# EAGLE design Irdroid_USB (EAGLE 6.5.0)
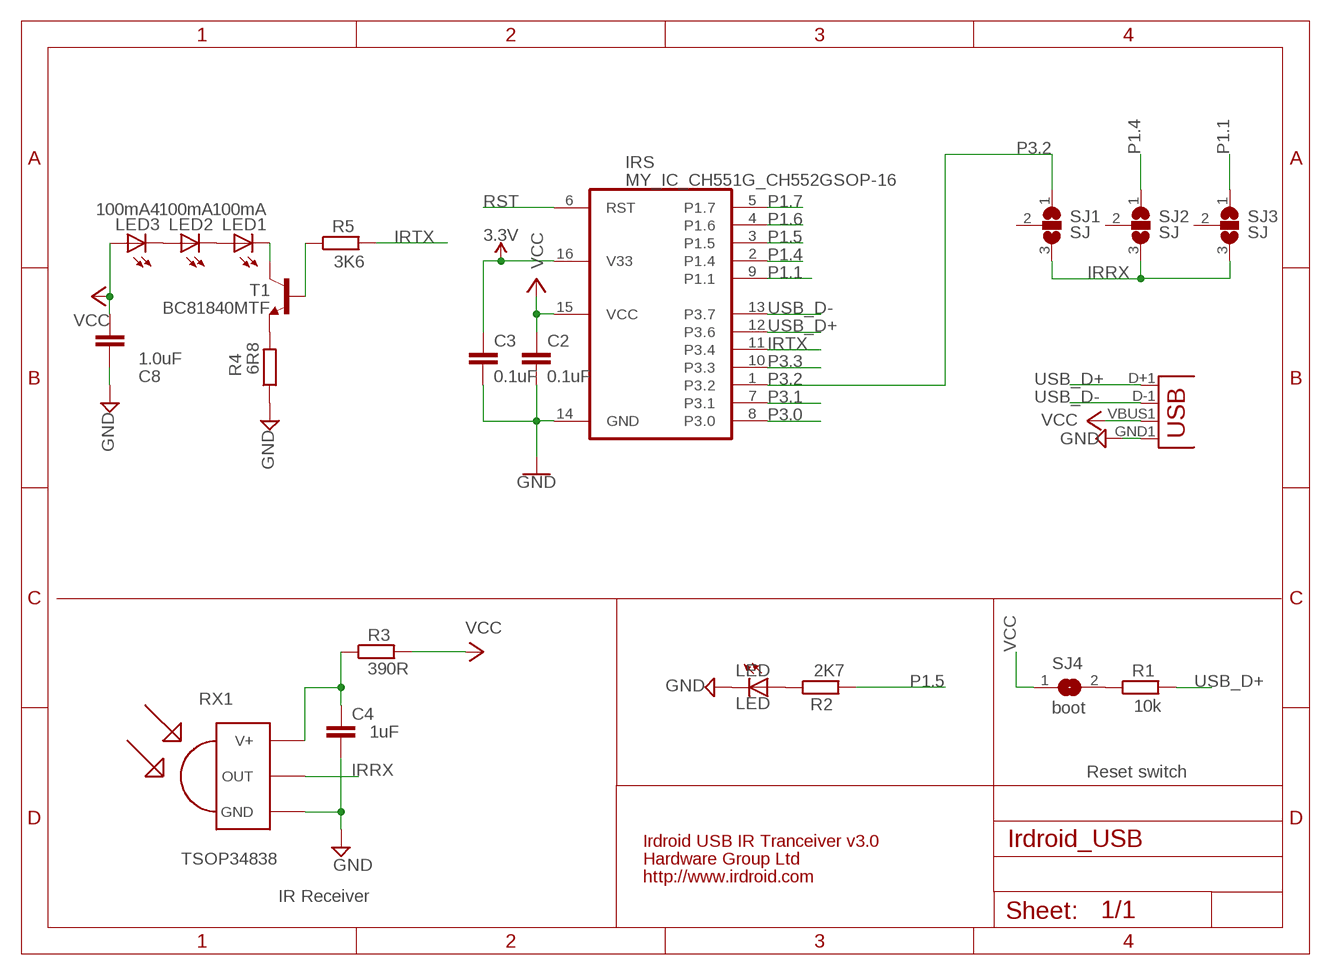
[diagram p0: schematic, sheet 1]

## Parts
C2  0.1uF  C-EUC0805K  [C0805K]
C3  0.1uF  C-EUC0805K  [C0805K]
C4  1uF  CAPC603  [C603]
C8  1.0uF  CAPC603  [C603]
IRS  MY_IC_CH551G_CH552GSOP-16  [MY_IC_SO16]
JP2  USBA-SMD-MALE  [USB-A-SMT-MALE]
LED  LED  LEDCHIP-LED0805  [CHIP-LED0805]
LED1  100mA  LED3MM  [LED3MM]
LED2  100mA  LED3MM  [LED3MM]
LED3  100mA4  LED3MM  [LED3MM]
R1  10k  RESISTORR603  [R603]
R2  2K7  RESISTORR603  [R603]
R3  390R  RESISTORR603  [R603]
R4  6R8  R-EU_M1206  [M1206]
R5  3K6  RESISTORR603  [R603]
RX  TSOP34838  TSOP4838  [TSOP18XX]
SJ1  SJ  SJ2W  [SJ_2]
SJ2  SJ  SJ2W  [SJ_2]
SJ3  SJ  SJ2W  [SJ_2]
SJ4  boot  SJ  [SJ]
T1  BC81840MTF  NPNSOT23BEC  [SOT23-BEC]

## Nets
3.3V: C3.1 IRS.16(V33)
GND: C2.2 C3.2 C4.2 C8.2 IRS.14(GND) JP2.GND1(GND) LED.C R4.1 RX.GND
IRRX: RX.OUT SJ1.3 SJ2.3 SJ3.3
IRTX: IRS.11(P3.4) R5.2
N$1: R1.1 SJ4.2
N$4: LED1.A LED2.K(C)
N$5: LED2.A LED3.K(C)
N$6: R4.2 T1.E
N$7: LED.A R2.1
N$8: C4.1 R3.1 RX.VCC(V+)
N$12: R5.1 T1.B
N$13: LED1.K(C) T1.C
P1.1: IRS.9(P1.1) SJ3.1
P1.4: IRS.2(P1.4) SJ2.1
P1.5: IRS.3(P1.5) R2.2
P1.6: IRS.4(P1.6)
P1.7: IRS.5(P1.7)
P3.0: IRS.8(P3.0)
P3.1: IRS.7(P3.1)
P3.2: IRS.1(P3.2) SJ1.1
P3.3: IRS.10(P3.3)
RST: IRS.6(RST)
USB_D+: IRS.12(P3.6) JP2.D+1(D+) R1.2
USB_D-: IRS.13(P3.7) JP2.D-1(D-)
VCC: C2.1 C8.1 IRS.15(VCC) JP2.VBUS1(VBUS) LED3.A R3.2 SJ4.1
Unconnected: SJ1.2 SJ2.2 SJ3.2

## Notes on the sheet
- RX1
- Reset switch
- Irdroid USB IR Tranceiver v3.0
- TSOP34838 | Hardware Group Ltd
- http://www.irdroid.com
- IR Receiver

## Library data of the parts
C2 C3 = rcl:C-EU: CAPACITOR, European symbol; LCSC: C16834; SPICEPREFIX: C
C4 C8 = dp_devices:CAP
IRS = myOwnLib:MY_IC_CH551G_CH552G; LCSC: C111292
JP2 = SparkFun-Connectors:USB: USB Connectors USB-B-PTH is fully proven SKU : PRT-00139/CONN-08278 USB-miniB is fully proven SKU : PRT-00587 USB-A-PCB is untested. USB-A-H is throughly reviewed, but untested. Spark Fun Electronics SKU : PRT-00437 USB-B-SMT is throughly reviewed, but untested. Needs silkscreen touching up. USB-A-S has not been used/tested USB-MB-H has not been used/tested USB-MICROB has been used. CONN-09505
LED LED1-LED3 = led:LED: LED OSRAM: - CHIPLED LG R971, LG N971, LY N971, LG Q971, LY Q971, LO R971, LY R971 LH N974, LH R974 LS Q976, LO Q976, LY Q976 LO Q996 - Hyper CHIPLED LW Q18S LB Q993, LB Q99A, LB R99A - SideLED LS A670, LO A670, LY A670, LG A670, LP A670 LB A673, LV A673, LT A673, LW A673 LH A674 LY A675 LS A676, LA A676, LO A676, LY A676, LW A676 LS A679, LY A679, LG A679 - Hyper Micro SIDELED® LS Y876, LA Y876, LO Y876, LY Y876 LT Y87S - SmartLED LW L88C, LW L88S LB L89C, LB L89S, LG L890 LS L89K, LO L89K, LY L89K LS L896, LA L896, LO L896, LY L896 - TOPLED LS T670, LO T670, LY T670, LG T670, LP T670 LSG T670, LSP T670, LSY T670, LOP T670, LYG T670 LG T671, LOG T671, LSG T671 LB T673, LV T673, LT T673, LW T673 LH T674 LS T676, LA T676, LO T676, LY T676, LB T676, LH T676, LSB T676, LW T676 LB T67C, LV T67C, LT T67C, LS T67K, LO T67K, LY T67K, LW E67C LS E67B, LA E67B, LO E67B, LY E67B, LB E67C, LV E67C, LT E67C LW T67C LS T679, LY T679, LG T679 LS T770, LO T770, LY T770, LG T770, LP T770 LB T773, LV T773, LT T773, LW T773 LH T774 LS E675, LA E675, LY E675, LS T675 LS T776, LA T776, LO T776, LY T776, LB T776 LHGB T686 LT T68C, LB T68C - Hyper Mini TOPLED® LB M676 - Mini TOPLED Santana® LG M470 LS M47K, LO M47K, LY M47K Source: http://www.osram.convergy.de LUXEON: - LUMILED® LXK2-PW12-R00, LXK2-PW12-S00, LXK2-PW14-U00, LXK2-PW14-V00 LXK2-PM12-R00, LXK2-PM12-S00, LXK2-PM14-U00 LXK2-PE12-Q00, LXK2-PE12-R00, LXK2-PE12-S00, LXK2-PE14-T00, LXK2-PE14-U00 LXK2-PB12-K00, LXK2-PB12-L00, LXK2-PB12-M00, LXK2-PB14-N00, LXK2-PB14-P00, LXK2-PB14-Q00 LXK2-PR12-L00, LXK2-PR12-M00, LXK2-PR14-Q00, LXK2-PR14-R00 LXK2-PD12-Q00, LXK2-PD12-R00, LXK2-PD12-S00 LXK2-PH12-R00, LXK2-PH12-S00 LXK2-PL12-P00, LXK2-PL12-Q00, LXK2-PL12-R00 Source: www.luxeon.com KINGBRIGHT: KA-3528ASYC Source: www.kingbright.com
R1-R3 R5 = dp_devices:RESISTOR
R4 = rcl:R-EU_: RESISTOR, European symbol
RX = tsop:TSOP4838: IR Receiver and Demodulator
SJ1-SJ3 = jumper:SJ2W: SMD solder JUMPER
SJ4 = jumper:SJ: SMD solder JUMPER
T1 = dp_devices:NPN

## Board
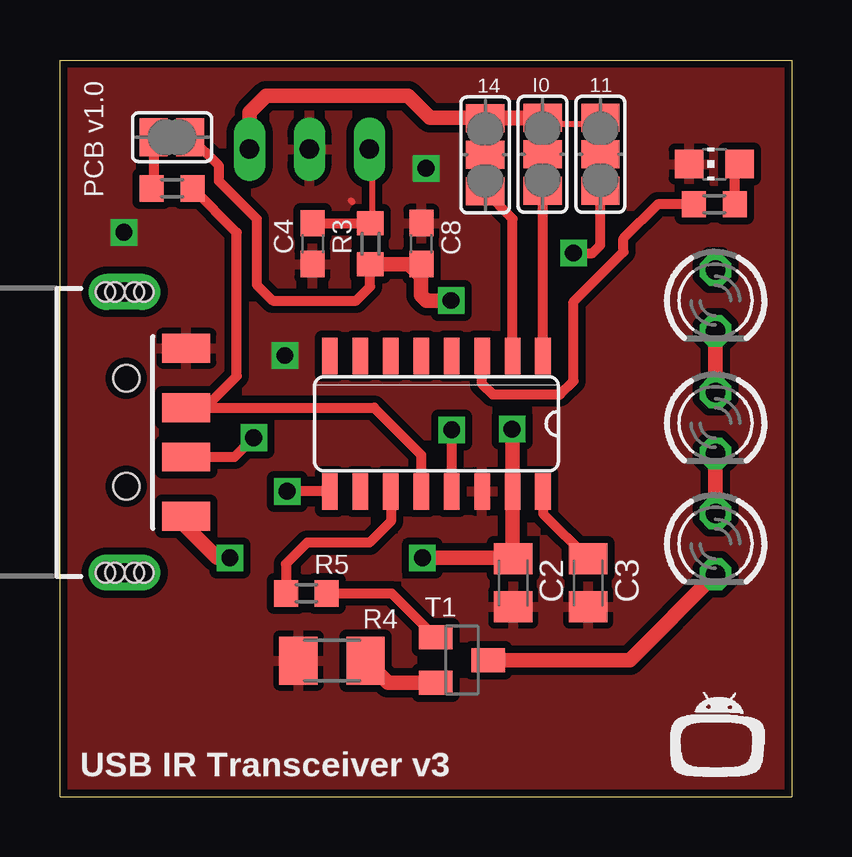
[diagram p1: board, top side]
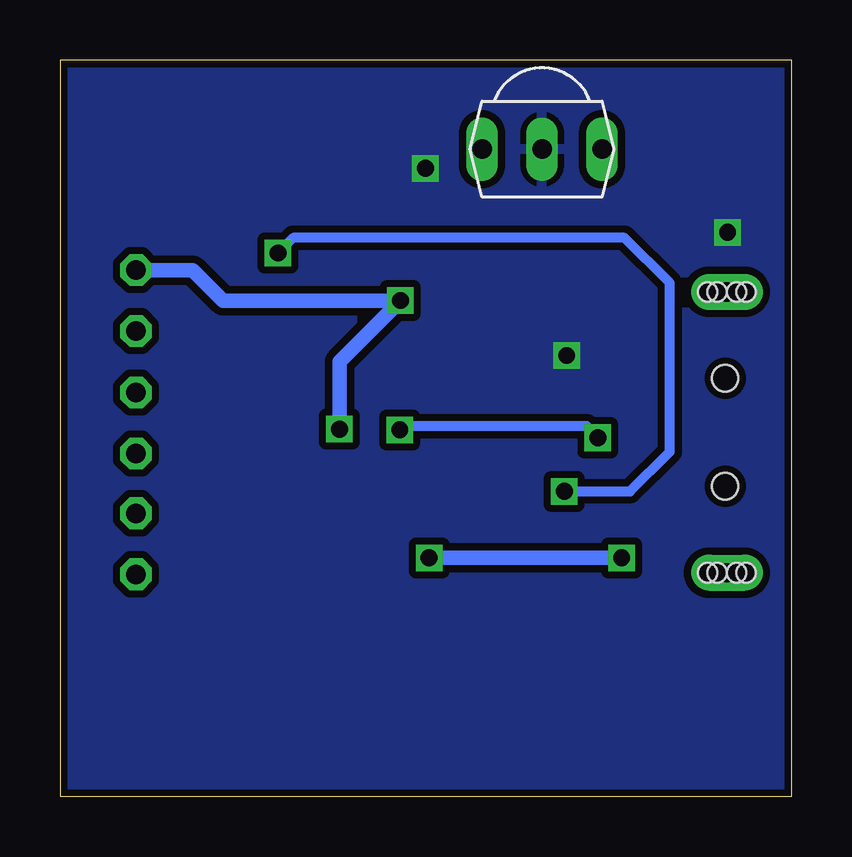
[diagram p2: board, bottom side, seen from below]

Size 30.5 x 30.7 mm. Coordinates in mm from the lower left corner, seen from the top.
Outline: 0,0 30.5,0 30.5,30.7 0,30.7 0,0
Copper layers (1*16): Top 0.035mm / dielectric 1.5mm / Bottom 0.035mm
Design rules "default": minimum track width 10mil, minimum drill 24mil, track to track 8mil, track to pad 8mil, pad to pad 8mil, via to via 8mil, smd to smd 8mil, copper to edge 12mil, drill to drill 8mil, minimum pad ring 10mil, minimum via ring 8mil, stop-mask expansion 4mil, vias tented up to drill 0mil, thermal gap 10mil

### Footprints (pad centres in the part's own frame; a part is rotated, then mirrored left to right if it is on the bottom)
C0805K = smd 1.3 x 1.6: 1 -1,0; 2 1,0
C603 = smd 1.1 x 1: 1 -0.85,0; 2 0.85,0
MY_IC_SO16 = smd 0.66 x 1.524: 1 -4.445,-2.819; 2 -3.175,-2.819; 3 -1.905,-2.819; 4 -0.635,-2.819; 5 0.635,-2.819; 6 1.905,-2.819; 7 3.175,-2.819; 8 4.445,-2.819; 9 4.445,2.819; 10 3.175,2.819; 11 1.905,2.819; 12 0.635,2.819; 13 -0.635,2.819; 14 -1.905,2.819; 15 -3.175,2.819; 16 -4.445,2.819
USB-A-SMT-MALE = smd 1.2 x 2: D+1 1.027,-3.67; D-1 -1.027,-3.67; GND1 3.5,-3.67; VBUS1 -3.5,-3.67 | drill 0.8 pad 1.5 long: P$1 5.85,-1.1; P$3 -5.85,-1.1 | hole 1.1: 2.25,-1.17; -2.25,-1.17 | hole 0.8: -5.85,-1.5; -5.85,-1.9; -5.85,-0.7; -5.85,-0.3; 5.85,-1.5; 5.85,-1.9; 5.85,-0.7; 5.85,-0.3
CHIP-LED0805 = smd 1.2 x 1.2: A 0,-1.05; C 0,1.05
LED3MM = drill 0.813 octagon: A -1.27,0; K 1.27,0
R603 = smd 1 x 1.1: 1 -0.85,0; 2 0.85,0
M1206 = smd 1.6 x 2: 1 -1.4,0; 2 1.4,0
TSOP18XX = drill 0.813 long: GND -0.001,-0.027; OUT -2.501,-0.027; VCC 2.499,-0.027
SJ_2 = smd 1.168 x 1.6: 1 -1.524,0; 2 0,0; 3 1.524,0
SJ = smd 1.168 x 1.6: 1 -0.762,0; 2 0.762,0
SOT23-BEC = smd 1 x 1.4: B -0.95,-1.1; C 0,1.1; E 0.95,-1.1

### Placement (x,y rotation side)
C2  18.9,8.92 270 top
C3  22.02,8.92 270 top
C4  10.53,23.05 270 top
C8  15.07,23.05 90 top
IRS  15.7,15.54 180 top
JP2  1.6,15.19 90 top
LED  27.28,26.37 90 top
LED1  27.33,10.54 270 top
LED2  27.33,15.57 270 top
LED3  27.33,20.68 270 top
R1  4.67,25.35 0 top
R2  27.28,24.69 180 top
R3  12.94,23.04 270 top
R4  11.34,5.67 0 top
R5  10.27,8.48 180 top
RX  10.4,26.96 180 bottom
SJ1  20.12,26.77 90 top
SJ2  17.73,26.75 90 top
SJ3  22.53,26.77 90 top
SJ4  4.67,27.48 180 top
T1  16.76,5.7 270 top

### Tracks (layer width: path | path; a pad name or v marks a point on that pad's centre or on a via)
3.3V
  Top 0.406: IRS.16 20.14,11.79 C3.1
GND  (via drill 0.7)
  Top 0.254: 12.19,24.79 12.13,24.85
  other vias: 15.27,26.19 2.67,23.52 9.37,18.39
  pour Bottom (isolate 0.305): 0.1,30.68 30.78,30.68 30.78,0 0.1,0
  pour Top (isolate 0.305): 0.1,30.68 30.68,30.68 30.68,0.1 0.1,0.1
IRRX
  Top 0.254: SJ3.3 21.95,28.04 20.32,28.04 SJ1.3
  Top 0.61: SJ2.3 20.09,28.27 SJ1.3 15.42,28.3 14.5,29.21 8.59,29.21 7.9,28.52 RX.OUT | SJ3.3 22.68,28.3 22.73,28.35 22.35,28.35 22.2,28.19 22.35,28.19 22.48,28.32
IRTX
  Top 0.406: IRS.11 13.79,11.48 12.9,10.59 10.31,10.59 9.42,9.7 R5.2
N$1
  Top 0.406: R1.1 3.94,25.46 3.94,27.46 SJ4.2
N$4
  Top 0.61: LED2.K LED1.A
N$5
  Top 0.61: LED3.K LED2.A
N$6
  Top 0.61: T1.E 13.67,4.75 R4.2
N$7
  Top 0.406: R2.1 28.13,26.16 LED.A
N$8
  Top 0.254: R3.1 13.01,23.98 13.01,26.82 RX.VCC
  Top 0.406: 12.9,23.93 R3.1 C4.1
N$12
  Top 0.406: R5.1 13.83,8.48 T1.B
N$13
  Top 0.61: T1.C 23.75,5.7 LED1.K
P1.1  (via drill 0.7)
  Top 0.406: IRS.9 v9.47,12.72 | v21.41,22.66 22.2,22.66 22.53,22.99 SJ3.1
  Bottom 0.406: v9.47,12.72 6.73,12.72 5.08,14.38 5.08,21.41 6.96,23.29 20.78,23.29 v21.41,22.66
P1.4
  Top 0.406: IRS.2 18.87,24.08 SJ2.1
P1.5
  Top 0.406: R2.2 24.92,24.69 23.5,23.27 23.5,22.71 21.41,20.62 21.41,17.32 20.85,16.76 18.03,16.76 17.6,17.2 IRS.3
P3.2
  Top 0.406: SJ1.1 20.12,18.39 IRS.1
USB_D+
  Top 0.406: IRS.12 15.06,14.25 13.1,16.21 JP2.D+1 6.05,16.21 7.37,17.53 7.37,23.51 R1.2
USB_D-  (via drill 0.7)
  Top 0.406: JP2.D-1 7.28,14.16 v8.08,14.96 | v16.33,15.29 IRS.13
  Bottom 0.406: v8.08,14.96 8.08,14.99 8.53,15.44 16.18,15.44 v16.33,15.29
VCC  (via drill 0.7)
  Top 0.406: 5.46,27.43 SJ4.1 6.63,26.29 6.63,25.65 8.2,24.08 8.2,21.34 8.87,20.68 12.34,20.68 12.93,21.26 R3.2
  Top 0.61: JP2.VBUS1 5.27,11.24 6.55,9.96 v7.09,9.96 | v15.11,9.96 18.86,9.96 | 18.86,9.96 C2.1 | 18.86,9.96 18.86,12.71 IRS.15 18.87,15.29 v18.85,15.32 | v16.31,20.68 15.29,20.68 15.06,20.9 15.06,21.69 | 15.06,21.69 C8.1 | R3.2 14.56,22.19 15.06,21.69
  Bottom 0.61: v7.09,9.96 v15.11,9.96 | LED3.A 24.97,21.95 23.7,20.68 v16.31,20.68 18.85,18.14 v18.85,15.32

### Text on the board
tNames: PCB v1.0 | 14 | I0 | 11 | USB IR Transceiver v3